# Altium project AMC_FMC_Carrier v4.PrjPcb (part 13 of 17)

## Sheet Clock_management.SchDoc: AMC FMC Carrier v4
size 420 x 297 mm; CompanyName: WUT; Organization: WUT ISE; Address1: Warsaw University of Technology; Address2: Nowowiejska 15/19 00-665 Warsaw; Address3: t.przywozki@gmail.com; Revision: 1; SheetNumber: 22; SheetTotal: 29; Project: AMC FMC Carrier v4.0.2; ModifiedBy: M. Biernat; CheckedDate: -; Title2: Clock Management; DivGrp: ISE; Designer: T. Przywozki; ModifiedDate: -; ProjectName: ADC/DAC MEZZANINE
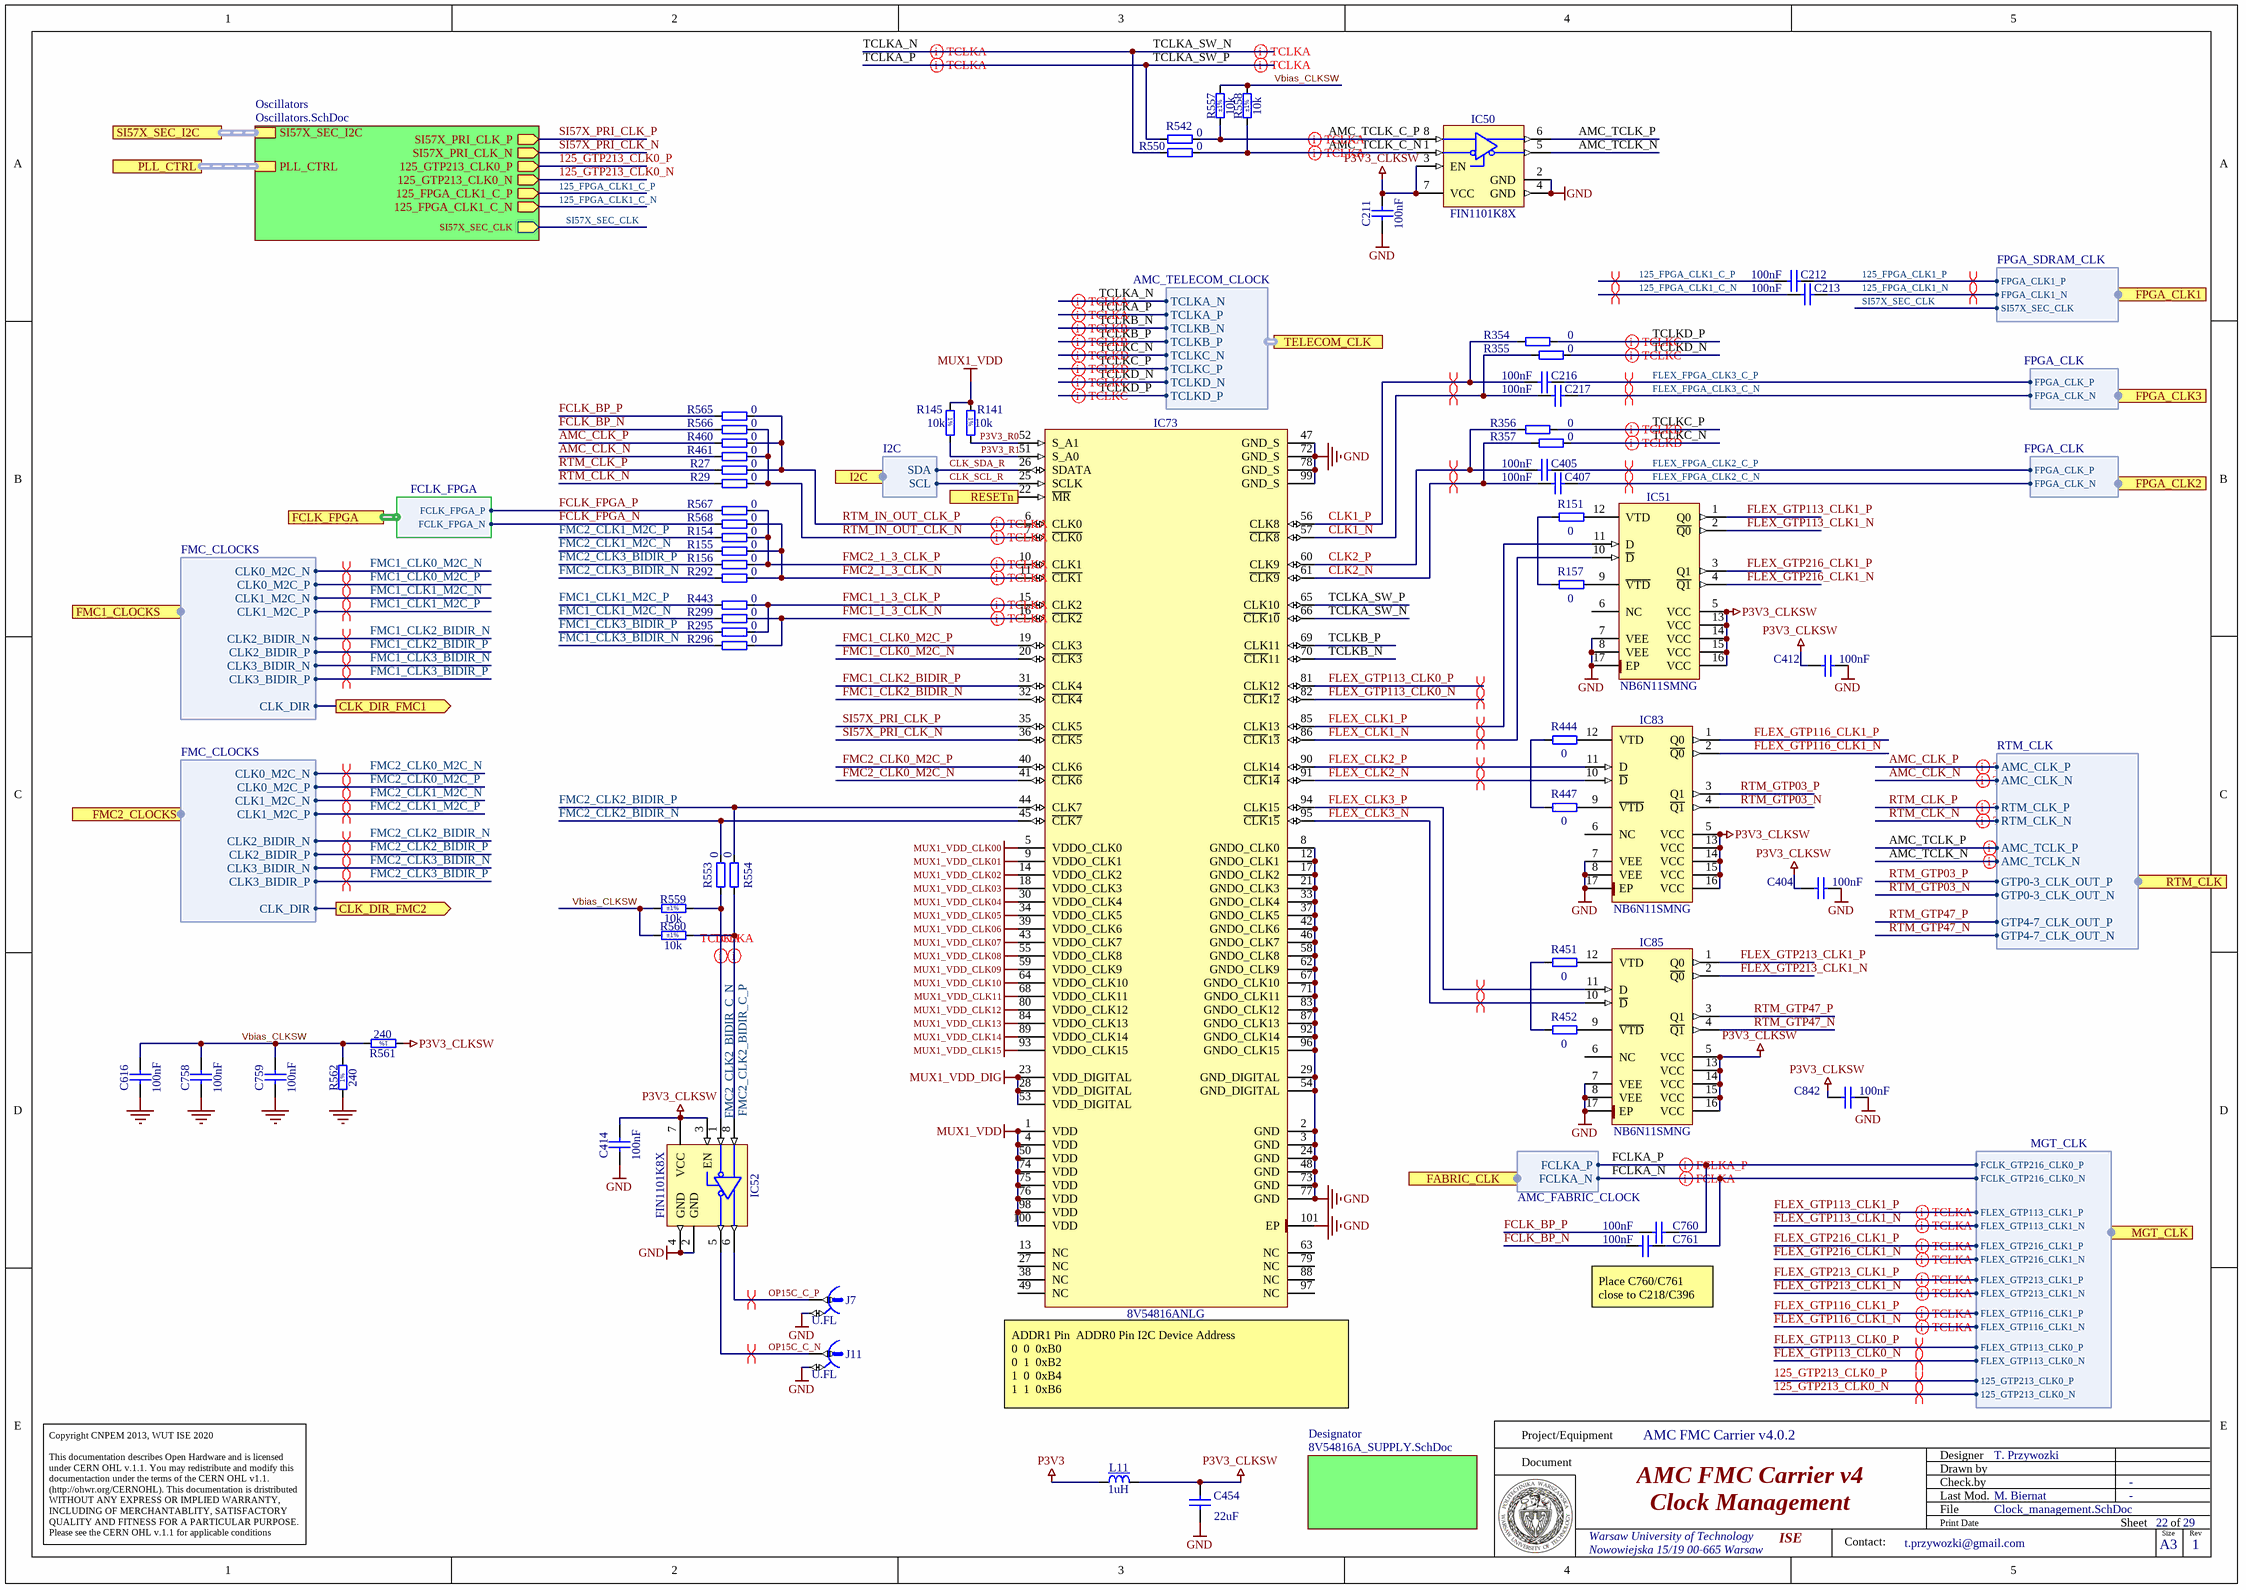
[diagram p23: Clock_management.SchDoc]

### Parts
C211  100nF  [CAPC1005X55N]
C212  100nF  [CAPC0603X33N]
C213  100nF  [CAPC0603X33N]
C216  100nF  [CAPC0603X33N]
C217  100nF  [CAPC0603X33N]
C404  100nF  [CAPC0603X33N]
C405  100nF  [CAPC0603X33N]
C407  100nF  [CAPC0603X33N]
C412  100nF  [CAPC0603X33N]
C414  100nF  [CAPC1005X55N]
C454  22uF  [CAPC3216X180N]
C616  100nF  [CAPC1005X55N]
C758  100nF  [CAPC1005X55N]
C759  100nF  [CAPC1005X55N]
C760  100nF  [CAPC0603X33N]
C761  100nF  [CAPC0603X33N]
C842  100nF  [CAPC0603X33N]
IC50  FIN1101K8X  [SOP50P310X90-8N]
IC51  NB6N11SMNG  [QFN50P300X300X100-17N-S185]
IC52  FIN1101K8X  [SOP50P310X90-8N]
IC73  8V54816ANLG  [QFN40P1200X1200X90-101N-S690]
IC83  NB6N11SMNG  [QFN50P300X300X100-17N-S185]
IC85  NB6N11SMNG  [QFN50P300X300X100-17N-S185]
J7  U.FL  [HIROSE_U.FL-R-SMT-1(10)]
J11  U.FL  [HIROSE_U.FL-R-SMT-1(10)]
L11  1uH  [IND_PANASONIC_ELLVGG]
R27  0  [RESC1005X40N]
R29  0  [RESC1005X40N]
R141  10k  [RESC1005X40N]
R145  10k  [RESC1005X40N]
R151  0  [RESC1005X40N]
R154  0  [RESC1005X40N]
R155  0  [RESC1005X40N]
R156  0  [RESC1005X40N]
R157  0  [RESC1005X40N]
R292  0  [RESC1005X40N]
R295  0  [RESC1005X40N]
R296  0  [RESC1005X40N]
R299  0  [RESC1005X40N]
R354  0  [RESC0603X28N]
R355  0  [RESC0603X28N]
R356  0  [RESC0603X28N]
R357  0  [RESC0603X28N]
R443  0  [RESC1005X40N]
R444  0  [RESC1005X40N]
R447  0  [RESC1005X40N]
R451  0  [RESC1005X40N]
R452  0  [RESC1005X40N]
R460  0  [RESC1005X40N]
R461  0  [RESC1005X40N]
R542  0  [RESC1005X40N]
R550  0  [RESC1005X40N]
R553  0  [RESC1005X40N]
R554  0  [RESC1005X40N]
R557  10k  Tolerance: ±1%  [RESC1005X40N]
R558  10k  Tolerance: ±1%  [RESC1005X40N]
R559  10k  Tolerance: ±1%  [RESC1005X40N]
R560  10k  Tolerance: ±1%  [RESC1005X40N]
R561  240  [RESC1005X40N]
R562  240  [RESC1005X40N]
R565  0  [RESC1005X40N]
R566  0  [RESC1005X40N]
R567  0  [RESC1005X40N]
R568  0  [RESC1005X40N]

### Sub-sheets
Designator = 8V54816A_SUPPLY.SchDoc: no entries
Oscillators = Oscillators.SchDoc: SI57X_PRI_CLK_P (out), SI57X_PRI_CLK_N (out), SI57X_SEC_CLK (out), 125_FPGA_CLK1_C_N (out), 125_FPGA_CLK1_C_P (out), 125_GTP213_CLK0_N (out), 125_GTP213_CLK0_P (out), SI57X_SEC_I2C (harness SI57X_SEC_I2C), PLL_CTRL (harness PLL_CTRL)

### Ports
CLK_DIR_FMC1 (out), CLK_DIR_FMC2 (out), FABRIC_CLK (harness AMC_FABRIC_CLOCK), FCLK_FPGA (harness FCLK_FPGA), FMC1_CLOCKS (harness FMC_CLOCKS), FMC2_CLOCKS (harness FMC_CLOCKS), FPGA_CLK1 (harness FPGA_SDRAM_CLK), FPGA_CLK2 (harness FPGA_CLK), FPGA_CLK3 (harness FPGA_CLK), I2C (harness I2C), MGT_CLK (harness MGT_CLK), PLL_CTRL (harness PLL_CTRL), RESETn (in), RTM_CLK (harness RTM_CLK), SI57X_SEC_I2C (harness SI57X_SEC_I2C), TELECOM_CLK (harness AMC_TELECOM_CLOCK)

### Harnesses
AMC_FABRIC_CLOCK: FCLKA_N, FCLKA_P
AMC_TELECOM_CLOCK: TCLKA_N, TCLKA_P, TCLKB_N, TCLKB_P, TCLKC_N, TCLKC_P, TCLKD_N, TCLKD_P
MGT_CLK: FCLK_GTP216_CLK0_P, FCLK_GTP216_CLK0_N, FLEX_GTP216_CLK1_P, FLEX_GTP216_CLK1_N, FLEX_GTP113_CLK1_P, FLEX_GTP113_CLK1_N, FLEX_GTP213_CLK1_P, FLEX_GTP213_CLK1_N, FLEX_GTP116_CLK1_P, FLEX_GTP116_CLK1_N, FLEX_GTP113_CLK0_P, FLEX_GTP113_CLK0_N, 125_GTP213_CLK0_P, 125_GTP213_CLK0_N
FPGA_SDRAM_CLK: FPGA_CLK1_N, FPGA_CLK1_P, SI57X_SEC_CLK
I2C: SCL, SDA
FMC_CLOCKS: CLK0_M2C_N, CLK0_M2C_P, CLK1_M2C_N, CLK1_M2C_P, CLK_DIR, CLK2_BIDIR_N, CLK2_BIDIR_P, CLK3_BIDIR_N, CLK3_BIDIR_P
FPGA_CLK: FPGA_CLK_N, FPGA_CLK_P
RTM_CLK: GTP0-3_CLK_OUT_P, GTP0-3_CLK_OUT_N, GTP4-7_CLK_OUT_P, GTP4-7_CLK_OUT_N, AMC_TCLK_P, AMC_TCLK_N, RTM_CLK_P, RTM_CLK_N, AMC_CLK_P, AMC_CLK_N
FCLK_FPGA: FCLK_FPGA_N, FCLK_FPGA_P

### Nets
GND: C211.1 C404.1 C412.1 C414.1 C454.1 C616.1 C758.1 C759.1 C842.1 IC50.2(GND) IC50.4(GND) IC51.7(VEE) IC51.8(VEE) IC51.17(EP) IC52.2(GND) IC52.4(GND) IC73.2(GND) IC73.3(GND) IC73.8(GNDO_CLK0) IC73.12(GNDO_CLK1) IC73.17(GNDO_CLK2) IC73.21(GNDO_CLK3) IC73.24(GND) IC73.29(GND_DIGITAL) IC73.33(GNDO_CLK4) IC73.37(GNDO_CLK5) IC73.42(GNDO_CLK6) IC73.46(GNDO_CLK7) IC73.47(GND_S) IC73.48(GND) IC73.54(GND_DIGITAL) IC73.58(GNDO_CLK8) IC73.62(GNDO_CLK9) IC73.67(GNDO_CLK10) IC73.71(GNDO_CLK11) IC73.72(GND_S) IC73.73(GND) IC73.77(GND) IC73.78(GND_S) IC73.83(GNDO_CLK12) IC73.87(GNDO_CLK13) IC73.92(GNDO_CLK14) IC73.96(GNDO_CLK15) IC73.99(GND_S) IC73.101(EP) IC83.7(VEE) IC83.8(VEE) IC83.17(EP) IC85.7(VEE) IC85.8(VEE) IC85.17(EP) J7.2 J11.2 R562.1
MUX1_VDD: IC73.1(VDD) IC73.4(VDD) IC73.50(VDD) IC73.74(VDD) IC73.75(VDD) IC73.76(VDD) IC73.98(VDD) IC73.100(VDD) R141.2 R145.2
MUX1_VDD_CLK00: IC73.5(VDDO_CLK0)
MUX1_VDD_CLK01: IC73.9(VDDO_CLK1)
MUX1_VDD_CLK02: IC73.14(VDDO_CLK2)
MUX1_VDD_CLK03: IC73.18(VDDO_CLK3)
MUX1_VDD_CLK04: IC73.30(VDDO_CLK4)
MUX1_VDD_CLK05: IC73.34(VDDO_CLK5)
MUX1_VDD_CLK06: IC73.39(VDDO_CLK6)
MUX1_VDD_CLK07: IC73.43(VDDO_CLK7)
MUX1_VDD_CLK08: IC73.55(VDDO_CLK8)
MUX1_VDD_CLK09: IC73.59(VDDO_CLK9)
MUX1_VDD_CLK10: IC73.64(VDDO_CLK10)
MUX1_VDD_CLK11: IC73.68(VDDO_CLK11)
MUX1_VDD_CLK12: IC73.80(VDDO_CLK12)
MUX1_VDD_CLK13: IC73.84(VDDO_CLK13)
MUX1_VDD_CLK14: IC73.89(VDDO_CLK14)
MUX1_VDD_CLK15: IC73.93(VDDO_CLK15)
MUX1_VDD_DIG: IC73.23(VDD_DIGITAL) IC73.28(VDD_DIGITAL) IC73.53(VDD_DIGITAL)
P3V3: L11.1
P3V3_CLKSW: C211.2 C404.2 C412.2 C414.2 C454.2 C842.2 IC50.3(EN) IC50.7(VCC) IC51.5(VCC) IC51.13(VCC) IC51.14(VCC) IC51.15(VCC) IC51.16(VCC) IC52.3(EN) IC52.7(VCC) IC83.5(VCC) IC83.13(VCC) IC83.14(VCC) IC83.15(VCC) IC83.16(VCC) IC85.5(VCC) IC85.13(VCC) IC85.14(VCC) IC85.15(VCC) IC85.16(VCC) L11.2 R561.1
125_FPGA_CLK1_C_N: C213.1 ; sheet Oscillators/125_FPGA_CLK1_C_N
125_FPGA_CLK1_C_P: C212.1 ; sheet Oscillators/125_FPGA_CLK1_C_P
125_FPGA_CLK1_N: C213.2 ; port FPGA_CLK1.FPGA_CLK1_N  [project net FPGA_CLK.FPGA_CLK1_N]
125_FPGA_CLK1_P: C212.2 ; port FPGA_CLK1.FPGA_CLK1_P  [project net FPGA_CLK.FPGA_CLK1_P]
125_GTP213_CLK0_N: sheet Oscillators/125_GTP213_CLK0_N, port MGT_CLK.125_GTP213_CLK0_N  [project net MGT.125_GTP213_CLK0_N]
125_GTP213_CLK0_P: sheet Oscillators/125_GTP213_CLK0_P, port MGT_CLK.125_GTP213_CLK0_P  [project net MGT.125_GTP213_CLK0_P]
AMC_CLK_N: R461.1 ; port RTM_CLK.AMC_CLK_N
AMC_CLK_P: R460.1 ; port RTM_CLK.AMC_CLK_P
AMC_TCLK_C_N: IC50.1(RIN-) R550.2 R558.1
AMC_TCLK_C_P: IC50.8(RIN+) R542.2 R557.1
AMC_TCLK_N: IC50.5(DOUT-) ; port RTM_CLK.AMC_TCLK_N
AMC_TCLK_P: IC50.6(DOUT+) ; port RTM_CLK.AMC_TCLK_P
CLK1_N: C217.1 IC73.57(~{CLK8}) R355.1
CLK1_P: C216.1 IC73.56(CLK8) R354.1
CLK2_N: C407.1 IC73.61(~{CLK9}) R357.1
CLK2_P: C405.1 IC73.60(CLK9) R356.1
CLK_DIR: port CLK_DIR_FMC2, port FMC2_CLOCKS.CLK_DIR
CLK_SCL_R: IC73.25(SCLK) ; port I2C.SCL  [project net CLK_I2C.SCL]
CLK_SDA_R: IC73.26(SDATA) ; port I2C.SDA  [project net CLK_I2C.SDA]
CLKS1.CLK_DIR: port CLK_DIR_FMC1, port FMC1_CLOCKS.CLK_DIR
FCLK_BP_N: C761.1 R566.1
FCLK_BP_P: C760.1 R565.1
FCLK_FPGA_N: R568.1 ; port FCLK_FPGA.FCLK_FPGA_N
FCLK_FPGA_P: R567.1 ; port FCLK_FPGA.FCLK_FPGA_P
FCLKA_N: C761.2 ; port FABRIC_CLK.FCLKA_N, port MGT_CLK.FCLK_GTP216_CLK0_N  [project net MGT.FCLK_GTP216_CLK0_N]
FCLKA_P: C760.2 ; port FABRIC_CLK.FCLKA_P, port MGT_CLK.FCLK_GTP216_CLK0_P  [project net MGT.FCLK_GTP216_CLK0_P]
FLEX_CLK1_N: IC51.10(~{D}) IC73.86(~{CLK}1~{3})
FLEX_CLK1_P: IC51.11(D) IC73.85(CLK13)
FLEX_CLK2_N: IC73.91(~{CLK}1~{4}) IC83.10(~{D})
FLEX_CLK2_P: IC73.90(CLK14) IC83.11(D)
FLEX_CLK3_N: IC73.95(~{CLK}1~{5}) IC85.10(~{D})
FLEX_CLK3_P: IC73.94(CLK15) IC85.11(D)
FLEX_FPGA_CLK2_C_N: C407.2 ; port FPGA_CLK2.FPGA_CLK_N
FLEX_FPGA_CLK2_C_P: C405.2 ; port FPGA_CLK2.FPGA_CLK_P
FLEX_FPGA_CLK3_C_N: C217.2 ; port FPGA_CLK3.FPGA_CLK_N
FLEX_FPGA_CLK3_C_P: C216.2 ; port FPGA_CLK3.FPGA_CLK_P
FLEX_GTP113_CLK0_N: IC73.82(~{CLK}1~{2}) ; port MGT_CLK.FLEX_GTP113_CLK0_N  [project net MGT.FLEX_GTP113_CLK0_N]
FLEX_GTP113_CLK0_P: IC73.81(CLK12) ; port MGT_CLK.FLEX_GTP113_CLK0_P  [project net MGT.FLEX_GTP113_CLK0_P]
FLEX_GTP113_CLK1_N: IC51.2(~{Q0}) ; port MGT_CLK.FLEX_GTP113_CLK1_N  [project net MGT.FLEX_GTP113_CLK1_N]
FLEX_GTP113_CLK1_P: IC51.1(Q0) ; port MGT_CLK.FLEX_GTP113_CLK1_P  [project net MGT.FLEX_GTP113_CLK1_P]
FLEX_GTP116_CLK1_N: IC83.2(~{Q0}) ; port MGT_CLK.FLEX_GTP116_CLK1_N  [project net MGT.FLEX_GTP116_CLK1_N]
FLEX_GTP116_CLK1_P: IC83.1(Q0) ; port MGT_CLK.FLEX_GTP116_CLK1_P  [project net MGT.FLEX_GTP116_CLK1_P]
FLEX_GTP213_CLK1_N: IC85.2(~{Q0}) ; port MGT_CLK.FLEX_GTP213_CLK1_N  [project net MGT.FLEX_GTP213_CLK1_N]
FLEX_GTP213_CLK1_P: IC85.1(Q0) ; port MGT_CLK.FLEX_GTP213_CLK1_P  [project net MGT.FLEX_GTP213_CLK1_P]
FLEX_GTP216_CLK1_N: IC51.4(~{Q1}) ; port MGT_CLK.FLEX_GTP216_CLK1_N  [project net MGT.FLEX_GTP216_CLK1_N]
FLEX_GTP216_CLK1_P: IC51.3(Q1) ; port MGT_CLK.FLEX_GTP216_CLK1_P  [project net MGT.FLEX_GTP216_CLK1_P]
FMC1_1_3_CLK_N: IC73.16(~{CLK2}) R296.2 R299.2
FMC1_1_3_CLK_P: IC73.15(CLK2) R295.2 R443.2
FMC1_CLK0_M2C_N: IC73.20(~{CLK3}) ; port FMC1_CLOCKS.CLK0_M2C_N  [project net CLKS1.CLK0_M2C_N]
FMC1_CLK0_M2C_P: IC73.19(CLK3) ; port FMC1_CLOCKS.CLK0_M2C_P  [project net CLKS1.CLK0_M2C_P]
FMC1_CLK1_M2C_N: R299.1 ; port FMC1_CLOCKS.CLK1_M2C_N  [project net CLKS1.CLK1_M2C_N]
FMC1_CLK1_M2C_P: R443.1 ; port FMC1_CLOCKS.CLK1_M2C_P  [project net CLKS1.CLK1_M2C_P]
FMC1_CLK2_BIDIR_N: IC73.32(~{CLK4}) ; port FMC1_CLOCKS.CLK2_BIDIR_N  [project net CLKS1.CLK2_BIDIR_N]
FMC1_CLK2_BIDIR_P: IC73.31(CLK4) ; port FMC1_CLOCKS.CLK2_BIDIR_P  [project net CLKS1.CLK2_BIDIR_P]
FMC1_CLK3_BIDIR_N: R296.1 ; port FMC1_CLOCKS.CLK3_BIDIR_N  [project net CLKS1.CLK3_BIDIR_N]
FMC1_CLK3_BIDIR_P: R295.1 ; port FMC1_CLOCKS.CLK3_BIDIR_P  [project net CLKS1.CLK3_BIDIR_P]
FMC2_1_3_CLK_N: IC73.11(~{CLK1}) R155.2 R292.2 R568.2
FMC2_1_3_CLK_P: IC73.10(CLK1) R154.2 R156.2 R567.2
FMC2_CLK0_M2C_N: IC73.41(~{CLK6}) ; port FMC2_CLOCKS.CLK0_M2C_N  [project net CLK0_M2C_N]
FMC2_CLK0_M2C_P: IC73.40(CLK6) ; port FMC2_CLOCKS.CLK0_M2C_P  [project net CLK0_M2C_P]
FMC2_CLK1_M2C_N: R155.1 ; port FMC2_CLOCKS.CLK1_M2C_N  [project net CLK1_M2C_N]
FMC2_CLK1_M2C_P: R154.1 ; port FMC2_CLOCKS.CLK1_M2C_P  [project net CLK1_M2C_P]
FMC2_CLK2_BIDIR_C_N: IC52.1(RIN-) R553.1 R559.2
FMC2_CLK2_BIDIR_C_P: IC52.8(RIN+) R554.1 R560.2
FMC2_CLK2_BIDIR_N: IC73.45(~{CLK7}) R553.2 ; port FMC2_CLOCKS.CLK2_BIDIR_N  [project net CLK2_BIDIR_N]
FMC2_CLK2_BIDIR_P: IC73.44(CLK7) R554.2 ; port FMC2_CLOCKS.CLK2_BIDIR_P  [project net CLK2_BIDIR_P]
FMC2_CLK3_BIDIR_N: R292.1 ; port FMC2_CLOCKS.CLK3_BIDIR_N  [project net CLK3_BIDIR_N]
FMC2_CLK3_BIDIR_P: R156.1 ; port FMC2_CLOCKS.CLK3_BIDIR_P  [project net CLK3_BIDIR_P]
OP15C_C_N: IC52.5(DOUT-) J11.1
OP15C_C_P: IC52.6(DOUT+) J7.1
P3V3_R0: IC73.52(S_A1) R141.1
P3V3_R1: IC73.51(S_A0) R145.1
RESETn: IC73.22(~{MR}) ; port RESETn
RTM_CLK_N: R29.1 ; port RTM_CLK.RTM_CLK_N
RTM_CLK_P: R27.1 ; port RTM_CLK.RTM_CLK_P
RTM_GTP03_N: IC83.4(~{Q1}) ; port RTM_CLK.GTP0-3_CLK_OUT_N  [project net GTP0-3_CLK_OUT_N]
RTM_GTP03_P: IC83.3(Q1) ; port RTM_CLK.GTP0-3_CLK_OUT_P  [project net GTP0-3_CLK_OUT_P]
RTM_GTP47_N: IC85.4(~{Q1}) ; port RTM_CLK.GTP4-7_CLK_OUT_N  [project net GTP4-7_CLK_OUT_N]
RTM_GTP47_P: IC85.3(Q1) ; port RTM_CLK.GTP4-7_CLK_OUT_P  [project net GTP4-7_CLK_OUT_P]
RTM_IN_OUT_CLK_N: IC73.7(~{CLK0}) R29.2 R461.2 R566.2
RTM_IN_OUT_CLK_P: IC73.6(CLK0) R27.2 R460.2 R565.2
SI57X_PRI_CLK_N: IC73.36(~{CLK5}) ; sheet Oscillators/SI57X_PRI_CLK_N
SI57X_PRI_CLK_P: IC73.35(CLK5) ; sheet Oscillators/SI57X_PRI_CLK_P
SI57X_SEC_CLK: sheet Oscillators/SI57X_SEC_CLK, port FPGA_CLK1.SI57X_SEC_CLK  [project net FPGA_CLK.SI57X_SEC_CLK]
TCLKA_N: IC73.66(~{CLK}1~{0}) R550.1 ; port TELECOM_CLK.TCLKA_N  [also labelled TCLKA_SW_N]
TCLKA_P: IC73.65(CLK10) R542.1 ; port TELECOM_CLK.TCLKA_P  [also labelled TCLKA_SW_P]
TCLKB_N: IC73.70(~{CLK}11) ; port TELECOM_CLK.TCLKB_N
TCLKB_P: IC73.69(CLK11) ; port TELECOM_CLK.TCLKB_P
TCLKC_N: R357.2 ; port TELECOM_CLK.TCLKC_N
TCLKC_P: R356.2 ; port TELECOM_CLK.TCLKC_P
TCLKD_N: R355.2 ; port TELECOM_CLK.TCLKD_N
TCLKD_P: R354.2 ; port TELECOM_CLK.TCLKD_P
Vbias_CLKSW: C616.2 C758.2 C759.2 R557.2 R558.2 R559.1 R560.1 R561.2 R562.2
NetIC51_9: IC51.9(~{VTD}) R157.2
NetIC51_12: IC51.12(VTD) R151.2
NetIC83_9: IC83.9(~{VTD}) R447.2
NetIC83_12: IC83.12(VTD) R444.2
NetIC85_9: IC85.9(~{VTD}) R452.2
NetIC85_12: IC85.12(VTD) R451.2
NetR151_1: R151.1 R157.1
NetR444_1: R444.1 R447.1
NetR451_1: R451.1 R452.1

Not connected (* = marked no-connect by the designer): IC51 6(NC); IC73 13(NC) 27(NC) 38(NC) 49(NC) 63(NC) 79(NC) 88(NC) 97(NC); IC83 6(NC); IC85 6(NC)

### Buses and harness runs
harness port PLL_CTRL = sheet Oscillators/PLL_CTRL
harness port SI57X_SEC_I2C = sheet Oscillators/SI57X_SEC_I2C

### Layout directives
differential pair: 125_FPGA_CLK1_C_N, 125_FPGA_CLK1_C_P, AMC_CLK_N, AMC_CLK_P, AMC_TCLK_C_N, AMC_TCLK_C_P, AMC_TCLK_N, AMC_TCLK_P, CLK0_M2C_N, CLK0_M2C_P, CLK1_M2C_N, CLK1_M2C_P, CLK1_N, CLK1_P, CLK2_BIDIR_N, CLK2_BIDIR_P, CLK2_N, CLK2_P, CLK3_BIDIR_N, CLK3_BIDIR_P, CLKS1.CLK0_M2C_N, CLKS1.CLK0_M2C_P, CLKS1.CLK1_M2C_N, CLKS1.CLK1_M2C_P, CLKS1.CLK2_BIDIR_N, CLKS1.CLK2_BIDIR_P, CLKS1.CLK3_BIDIR_N, CLKS1.CLK3_BIDIR_P, FLEX_CLK1_N, FLEX_CLK1_P, FLEX_CLK2_N, FLEX_CLK2_P, FLEX_CLK3_N, FLEX_CLK3_P, FLEX_FPGA_CLK2_C_N, FLEX_FPGA_CLK2_C_P, FLEX_FPGA_CLK3_C_N, FLEX_FPGA_CLK3_C_P, FMC1_1_3_CLK_N, FMC1_1_3_CLK_P, FMC2_1_3_CLK_N, FMC2_1_3_CLK_P, FMC2_CLK2_BIDIR_C_N, FMC2_CLK2_BIDIR_C_P, FPGA_CLK.FPGA_CLK1_N, FPGA_CLK.FPGA_CLK1_P, MGT.125_GTP213_CLK0_N, MGT.125_GTP213_CLK0_P, MGT.FCLK_GTP216_CLK0_N, MGT.FCLK_GTP216_CLK0_P, MGT.FLEX_GTP113_CLK0_N, MGT.FLEX_GTP113_CLK0_P, MGT.FLEX_GTP113_CLK1_N, MGT.FLEX_GTP113_CLK1_P, MGT.FLEX_GTP116_CLK1_N, MGT.FLEX_GTP116_CLK1_P, MGT.FLEX_GTP213_CLK1_N, MGT.FLEX_GTP213_CLK1_P, MGT.FLEX_GTP216_CLK1_N, MGT.FLEX_GTP216_CLK1_P, OP15C_C_N, OP15C_C_P, RTM_CLK_N, RTM_CLK_P, RTM_IN_OUT_CLK_N, RTM_IN_OUT_CLK_P, TCLKA_N, TCLKA_P, TCLKB_N, TCLKB_P, TCLKC_N, TCLKC_P, TCLKD_N, TCLKD_P

### Notes on the sheet
- Place C760/C761 close to C218/C396
- (near IC73) ADDR1 Pin 	ADDR0 Pin	I2C Device Address
  0		0		0xB0
  0		1		0xB2
  1		0		0xB4
  1		1		0xB6
- Project/Equipment
- Document
- Designer
- Drawn by
- Check.by
- Copyright CNPEM 2013, WUT ISE 2020
  This documentation describes Open Hardware and is licensed under CERN OHL v.1.1. You may redistribute and modify this documentaction under the terms of the CERN OHL v1.1.
  (http://ohwr.org/CERNOHL). This documentation is dristributed WITHOUT ANY EXPRESS OR IMPLIED WARRANTY, INCLUDING OF MERCHANTABLITY, SATISFACTORY QUALITY AND FITNESS FOR A PARTICULAR PURPOSE. Please see the CERN OHL v.1.1 for applicable conditions
- File
- Last Mod.
- Print Date
- Sheet
- Size
- A3
- of
- Rev
- Contact:
- (in symbol R0402_10K_1%_0.0625W_100PPM) 1%
- (in symbol R0402_240R_1%_0.0625W_100PPM) 1%

### Library data of the parts
C211 C414 C616 C758 C759 = CC0402_100NF_16V_10%_X5R: Non-polarised capacitor; Manufacturer: GENERIC; Part Description: SMD Multilayer Chip Ceramic Capacitor; Manufacturer1 Part Number: GRM155R61C104KA88D; Tolerance: ±10%; Voltage: 16V; TC: X5R; Manufacturer Part Number: CC0402_100NF_16V_10%_X5R; Part Number: CC0402_100NF_16V_10%_X5R; Value: 100nF; Component Kind: Standard; Component Type: Standard; Pin Count: 2; Status: None; Case: 0402; Mounted: Yes; Socket: No; SMD: Yes; Sense: No; Manufacturer1 Example: MURATA; Manufacturer1 ComponentHeight: 0.55mm; HelpURL: \\cern.ch\dfs\Applications\Altium\Datasheets\CC0402_X5R_MURATA_GRM.pdf; Author: CERN DEM JLC; CreateDate: 10.12.2013; LatestRevisionDate: 10.12.2013
C212 C213 C216 C217 C404 C405 C407 C412 C760 C761 C842 = CC0201_100NF_6.3V_10%_X5R: Non-polarised capacitor; Part Description: SMD Multilayer Chip Ceramic Capacitor; Manufacturer: GENERIC; Manufacturer1 Part Number: 02016D104KAT2A; Voltage: 6.3V; TC: X5R; Tolerance: ±10%; Table: Capacitors SMD; Part Number: CC0201_100NF_6.3V_10%_X5R; Component Kind: Standard; Component Type: Standard; Pin Count: 2; Value: 100nF; Status: Not Recommended; Manufacturer Part Number: CC0201_100NF_6.3V_10%_X5R; Case: 0201; Mounted: Yes; Socket: No; SMD: Yes; Manufacturer1 Example: AVX; Manufacturer1 ComponentHeight: 0.33mm; HelpURL: \\cern.ch\dfs\Applications\Altium\Datasheets\CC0201_X5R_AVX.pdf; Author: CERN DEM JLC; CreateDate: 2007-12-03; LatestRevisionDate: 2007-12-03
C454 = CC1206_22UF_10V_10%_X7R: Non-polarised capacitor; Part Description: SMD Multilayer Chip Ceramic Capacitor; Manufacturer: GENERIC; Manufacturer1 Part Number: GRM31CR71A226KE15L; Voltage: 10V; TC: X7R; Tolerance: ±10%; Table: Capacitors SMD; Part Number: CC1206_22UF_10V_10%_X7R; Component Kind: Standard; Component Type: Standard; Pin Count: 2; Value: 22uF; Status: Preferred; Manufacturer Part Number: CC1206_22UF_10V_10%_X7R; Case: 1206; Mounted: Yes; Socket: No; SMD: Yes; Manufacturer1 Example: MURATA; Manufacturer1 ComponentHeight: 1.8mm; HelpURL: \\cern.ch\dfs\Applications\Altium\Datasheets\CC1206_X7R_MURATA_GRM-HI-CAP.pdf; Author: CERN DEM JLC; CreateDate: 2010-06-08; LatestRevisionDate: 2010-06-08
IC50 IC52 = FIN1101K8X: LVDS Single Port High Speed Repeater; Manufacturer: FAIRCHILD SEMICONDUCTOR; PressFit: No; Bonding: No; Part Number: FIN1101K8X; Component Kind: Standard; Component Type: Standard; Device: FIN1101K8X; PackageDescription: SOP, 0.50mm Pitch; 8 pin, 2.30mm W X 2.00mm L X 0.90mm H body, PC Medium Density; Part Description: LVDS Single Port High Speed Repeater; Manufacturer Part Number: FIN1101K8X; Pin Count: 8; Case: TSSOP8; Mounted: Yes; Socket: No; SMD: Yes; Sense: No; ComponentHeight: 0.8mm; Author: CERN DEM JLC; HelpURL: \\cern.ch\dfs\Applications\Altium\Datasheets\FIN1101K8X.pdf; CreateDate: 08.11.2016; LatestRevisionDate: 08.11.2016
IC51 IC83 IC85 = NB6N11SMNG: 3.3V 1:2 AnyLevel Input to LVDS Fanout Buffer / Translator; Manufacturer: ON SEMICONDUCTOR; PressFit: No; Bonding: No; Part Number: NB6N11SMNG; Component Kind: Standard; Component Type: Standard; Device: NB6N11SMNG; PackageDescription: QFN, 0.50mm Pitch, Square; 16 Pin, 3.00mm L X 3.00mm W X 1.00mm H body (w/Thermal Tab 1.85 X 1.85mm), IPC Medium Density; Part Description: 3.3V 1:2 AnyLevel Input to LVDS Fanout Buffer / Translator; Manufacturer Part Number: NB6N11SMNG; Pin Count: 17; Case: QFN16; Mounted: Yes; Socket: No; SMD: Yes; Sense: No; ComponentHeight: 1mm; Author: CERN DEM JLC; HelpURL: \\cern.ch\dfs\Applications\Altium\Datasheets\NB6N11SMNG.pdf; CreateDate: 14.05.2013; LatestRevisionDate: 14.05.2013
IC73 = 8V54816ANLG: 16-Port, Bi-directional M-LVDS Clock Cross-Point Switch; Manufacturer: INTEGRATED DEVICE TECHNOLOGY (IDT); PressFit: No; Bonding: No; Part Number: 8V54816ANLG; Component Kind: Standard; Component Type: Standard; Device: 8V54816ANLG; PackageDescription: QFN, 0.40mm Pitch, Square; 100 Pin, 12.0mm L X 12.0mm W X 0.90mm H body (w/Thermal Tab 6.90 X 6.90mm), IPC Medium Density; Status: Not Recommended; Part Description: 16-Port, Bi-directional M-LVDS Clock Cross-Point Switch; Manufacturer Part Number: 8V54816ANLG; Pin Count: 101; Case: QFN100; Mounted: Yes; Socket: No; SMD: Yes; Sense: No; ComponentHeight: 0.9mm; Author: CERN DEM MR; HelpURL: \\cern.ch\dfs\Applications\Altium\Datasheets\8V54816ANLG.pdf; CreateDate: 02.06.2016; LatestRevisionDate: 30.03.2017
J7 J11 = HIROSE_U.FL-R-SMT-1(10): Part Description: Up to 6GHz Ultra Small Surface Mount Male Coaxial Connectors U.FL Series; Manufacturer: HIROSE (HRS); PressFit: No; Part Number: HIROSE_U.FL-R-SMT-1(10); Component Kind: Standard; Component Type: Standard; Pin Count: 2; Family: U.FL; Mounted: Yes; Socket: No; SMD: Yes; Sense: No; Status: None; Manufacturer Part Number: U.FL-R-SMT-1(10); ComponentHeight: 1.25mm; HelpURL: \\cern.ch\dfs\Applications\Altium\Datasheets\HIROSE_U.FL-R-SMT-1(10).pdf; Author: CERN DEM JLC; CreateDate: 24.03.2010; LatestRevisionDate: 24.03.2010
L11 = IND_1UH_30%_PANASONIC_ELLVGG1R0N: Inductor With Core; Part Description: Wire Wound SMD Power Inductor, G Series, Type ELLVGG; Power: 1.8A; Resistance: 0.052R; Tolerance: ±30%; Part Number: IND_1UH_30%_PANASONIC_ELLVGG1R0N; Component Kind: Standard; Component Type: Standard; Pin Count: 2; Value: 1uH; Status: None; Manufacturer: PANASONIC; Manufacturer Part Number: ELLVGG1R0N; Mounted: Yes; Socket: No; SMD: Yes; Sense: No; ComponentHeight: 1.5mm; HelpURL: \\cern.ch\dfs\Applications\Altium\Datasheets\IND_PANASONIC_ELLVGG.pdf; Author: CERN DEM JLC; CreateDate: 09.11.2016; LatestRevisionDate: 09.11.2016
R27 R29 R151 R154-R157 R292 R295 R296 R299 R443 R444 R447 R451 R452 R460 R461 R542 R550 R553 R554 R565-R568 = R0402_0R_JUMPER: Resistor; Part Description: 1A (0.05R Max DC Resistance) Zero Ohm Jumper; Manufacturer: GENERIC; Manufacturer1 Part Number: 232270591001L; PressFit: No; Part Number: R0402_0R_JUMPER; Component Kind: Standard; Component Type: Standard; Pin Count: 2; Value: 0; Status: Not Recommended; Manufacturer Part Number: R0402_0R_JUMPER; Case: 0402; Mounted: Yes; Sense: No; Socket: No; SMD: Yes; Manufacturer1 Example: YAGEO PHYCOMP; Manufacturer1 ComponentHeight: 0.4mm; HelpURL: \\cern.ch\dfs\Applications\Altium\Datasheets\R0402_Phycomp_RC0402.pdf; Author: CERN DEM JLC; CreateDate: 03.12.2007; LatestRevisionDate: 17.10.2012
R141 R145 = R0402_10K_1%_0.0625W_100PPM: Resistor - 1%; Part Description: General Purpose Thick Film Chip Resistor; Manufacturer: GENERIC; Manufacturer1 Part Number: 232270671003L; TC: ±100ppm/°C; Table: Resistors SMD; Part Number: R0402_10K_1%_0.0625W_100PPM; Component Kind: Standard; Component Type: Standard; Pin Count: 2; Value: 10k; Status: Not recommended; Power: 0.0625W; Tolerance: ±1%; Manufacturer Part Number: R0402_10K_1%_0.0625W_100PPM; Case: 0402; Mounted: Yes; Socket: No; SMD: Yes; Manufacturer1 Example: YAGEO PHYCOMP; Manufacturer1 ComponentHeight: 0.4mm; HelpURL: \\cern.ch\dfs\Applications\Altium\Datasheets\R0402_Phycomp_RC0402.pdf; Author: CERN DEM JLC; CreateDate: 2007-12-03; LatestRevisionDate: 2012-10-17
R354-R357 = R0201_0R_JUMPER: Resistor; Part Description: 1A (0.05R Max DC Resistance) Zero Ohm Jumper; Manufacturer: GENERIC; Manufacturer1 Part Number: CRCW02010000Z0ED; PressFit: No; Part Number: R0201_0R_JUMPER; Component Kind: Standard; Component Type: Standard; Pin Count: 2; Value: 0; Status: Not Recommended; Manufacturer Part Number: R0201_0R_JUMPER; Case: 0201; Mounted: Yes; Sense: No; Socket: No; SMD: Yes; Manufacturer1 Example: VISHAY; Manufacturer1 ComponentHeight: 0.27mm; HelpURL: \\cern.ch\dfs\Applications\Altium\Datasheets\R0201_VISHAY_CRCW e3.pdf; Author: CERN DEM JLC; CreateDate: 19.11.2014; LatestRevisionDate: 08.01.2015
R557-R560 = R0402_10K_1%_0.0625W_100PPM: Resistor - 1%; Part Description: General Purpose Thick Film Chip Resistor; Manufacturer: GENERIC; Manufacturer1 Part Number: 232270671003L; TC: ±100ppm/°C; PressFit: No; Part Number: R0402_10K_1%_0.0625W_100PPM; Component Kind: Standard; Component Type: Standard; Pin Count: 2; Value: 10k; Status: Not Recommended; Power: 0.0625W; Manufacturer Part Number: R0402_10K_1%_0.0625W_100PPM; Case: 0402; Mounted: Yes; Sense: No; Socket: No; SMD: Yes; Manufacturer1 Example: YAGEO PHYCOMP; Manufacturer1 ComponentHeight: 0.4mm; HelpURL: \\cern.ch\dfs\Applications\Altium\Datasheets\R0402_Phycomp_RC0402.pdf; Author: CERN DEM JLC; CreateDate: 03.12.2007; LatestRevisionDate: 17.10.2012
R561 R562 = R0402_240R_1%_0.0625W_100PPM: Resistor - 1%; Manufacturer: GENERIC; Part Description: General Purpose Thick Film Chip Resistor; Manufacturer1 Part Number: 232270672401L; TC: ±100ppm/°C; PressFit: No; Manufacturer Part Number: R0402_240R_1%_0.0625W_100PPM; Part Number: R0402_240R_1%_0.0625W_100PPM; Tolerance: ±1%; Value: 240; Component Kind: Standard; Component Type: Standard; Pin Count: 2; Status: Not Recommended; Power: 0.0625W; Case: 0402; Mounted: Yes; Sense: No; Socket: No; SMD: Yes; Manufacturer1 Example: YAGEO PHYCOMP; Manufacturer1 ComponentHeight: 0.4mm; HelpURL: \\cern.ch\dfs\Applications\Altium\Datasheets\R0402_Phycomp_RC0402.pdf; Author: CERN DEM JLC; CreateDate: 03.12.2007; LatestRevisionDate: 17.10.2012

## Sheet Oscillators.SchDoc: AMC FMC Carrier v4
size 420 x 297 mm; CompanyName: WUT; Organization: WUT ISE; Address1: Warsaw University of Technology; Address2: Nowowiejska 15/19 00-665 Warsaw; Address3: t.przywozki@gmail.com; Revision: 1; SheetNumber: 23; SheetTotal: 29; Project: AMC FMC Carrier v4.0.2; ModifiedBy: F. Świtakowski; CheckedDate: -; Title2: Oscillators; DivGrp: ISE; Designer: T. Przywozki; ModifiedDate: -; ProjectName: ADC/DAC MEZZANINE
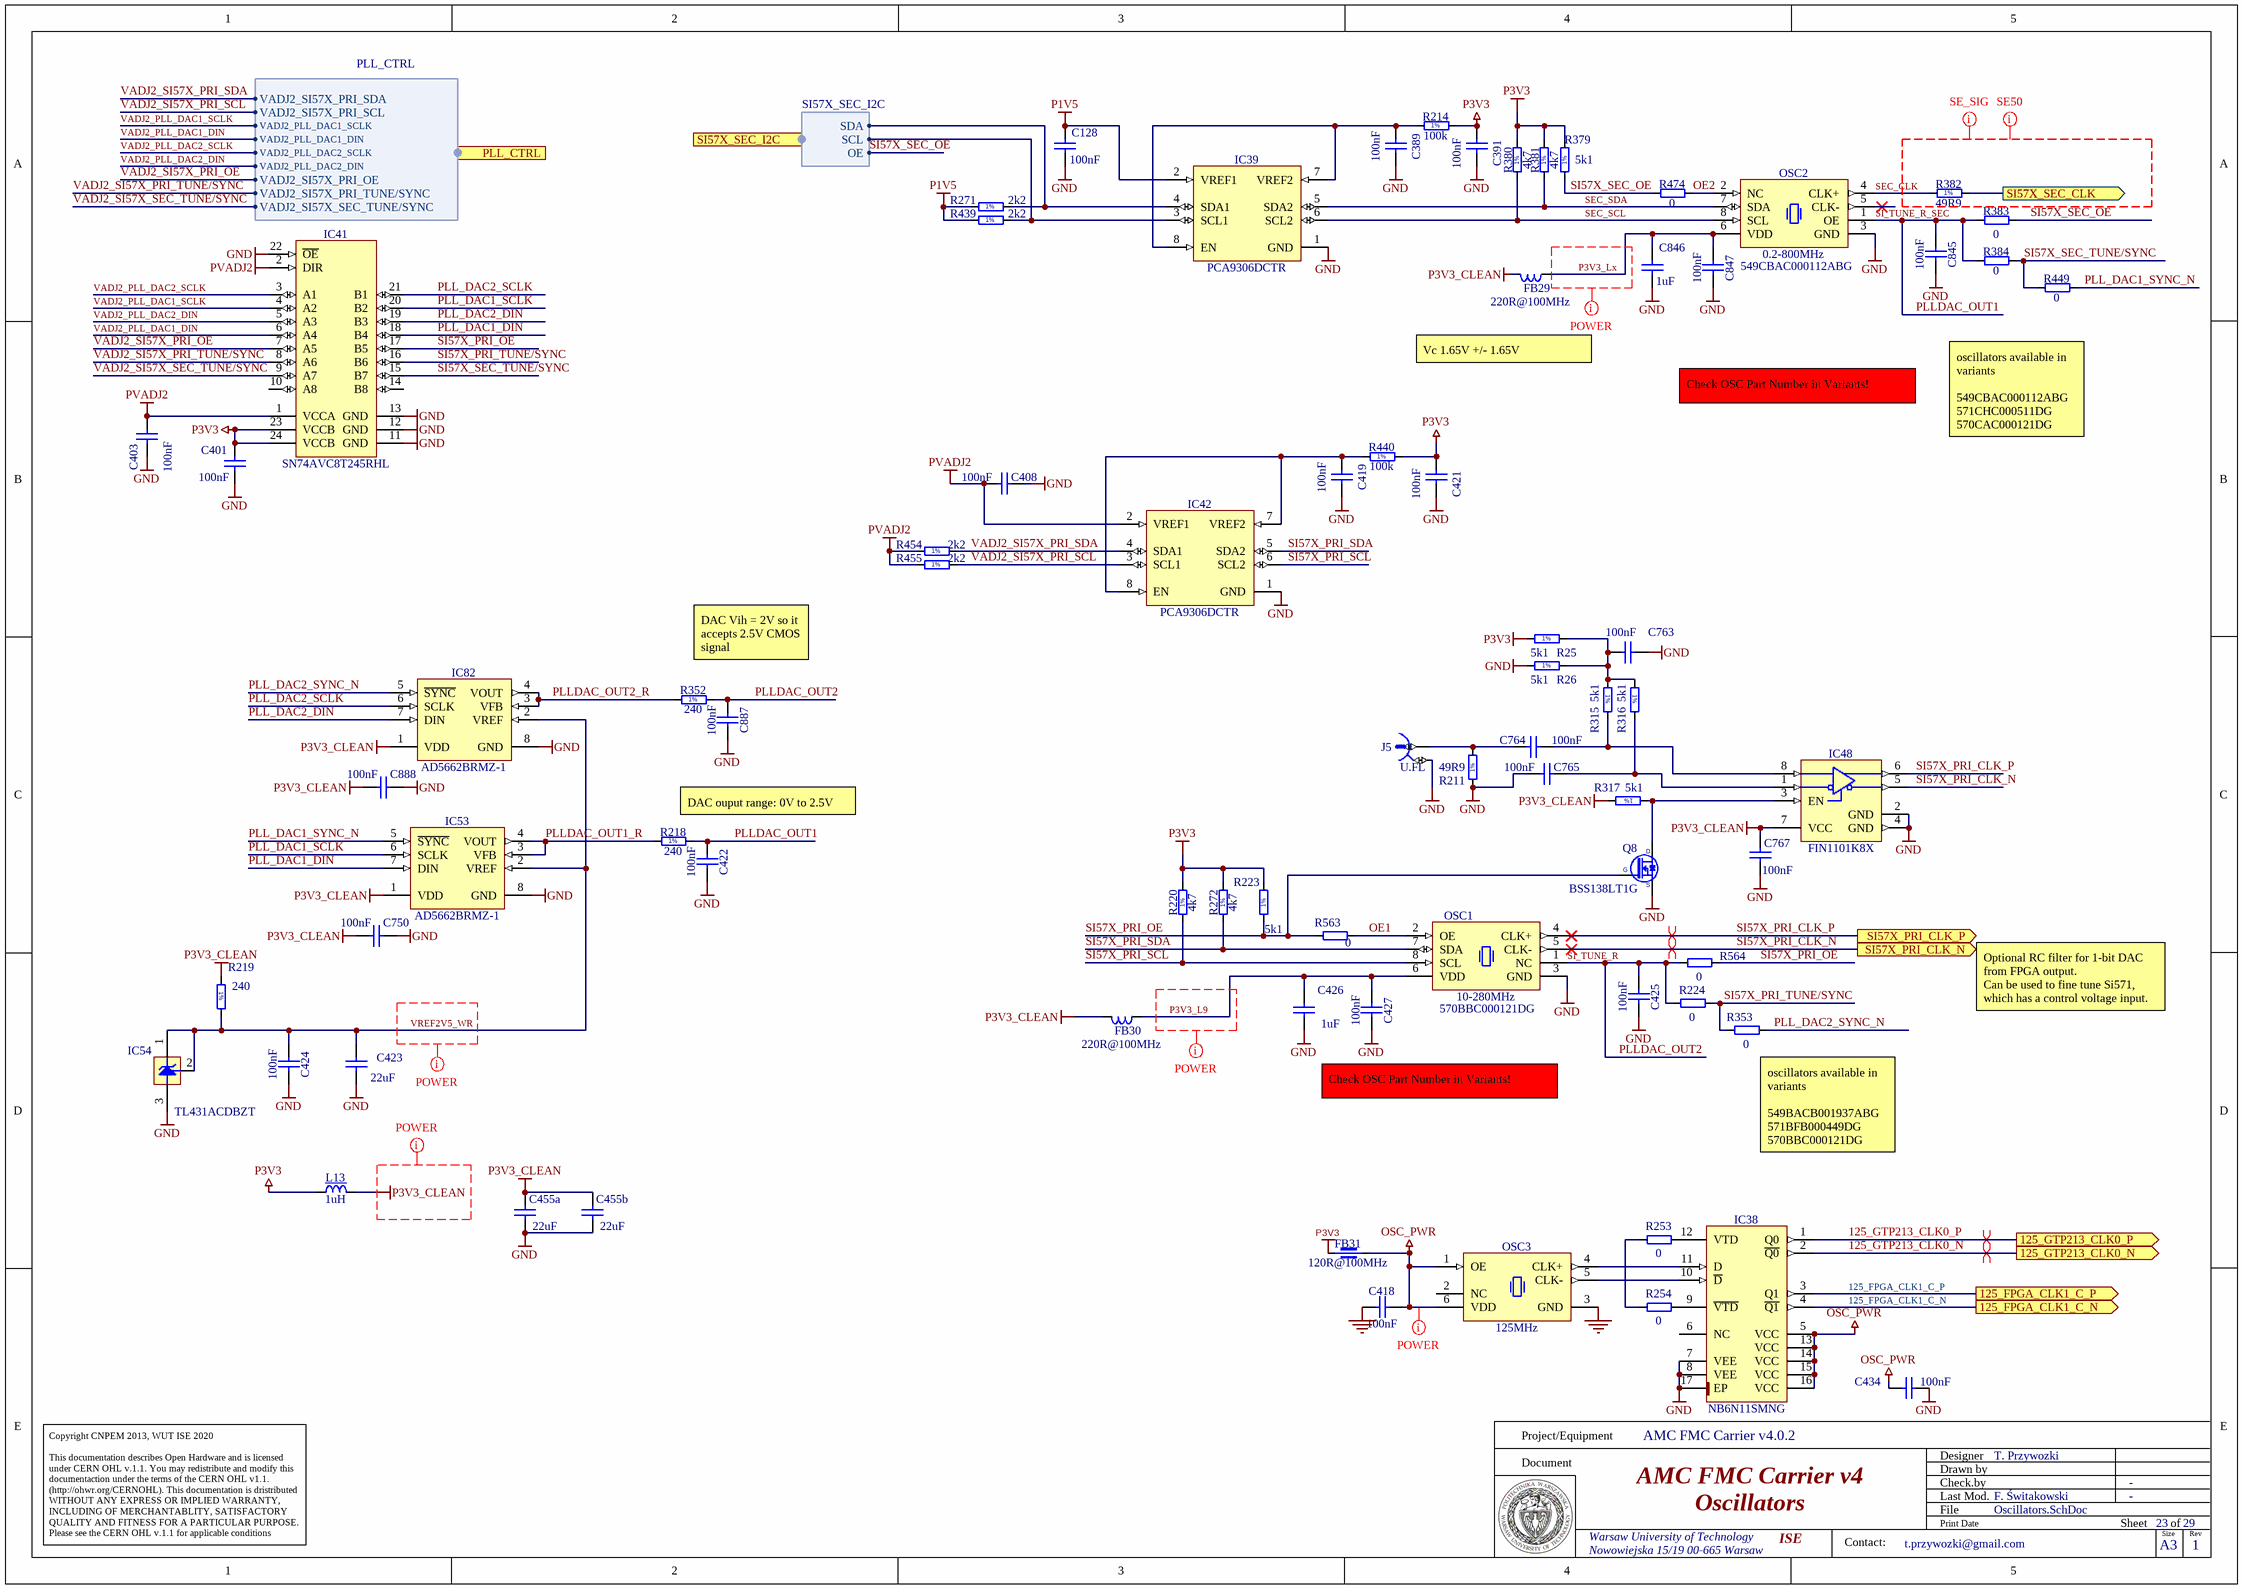
[diagram p24: Oscillators.SchDoc]

### Parts
C128  100nF  [CAPC0603X33N]
C389  100nF  [CAPC0603X33N]
C391  100nF  [CAPC0603X33N]
C401  100nF  [CAPC0603X33N]
C403  100nF  [CAPC0603X33N]
C408  100nF  [CAPC0603X33N]
C418  100nF  [CAPC0603X33N]
C419  100nF  [CAPC0603X33N]
C421  100nF  [CAPC0603X33N]
C422  100nF  [CAPC0603X33N]
C423  22uF  [CAPC3216X180N]
C424  100nF  [CAPC0603X33N]
C425  100nF  [CAPC0603X33N]
C426  1uF  [CAPC1608X87N]
C427  100nF  [CAPC0603X33N]
C434  100nF  [CAPC0603X33N]
C455a  22uF  [CAPC3216X180N]
C455b  22uF  [CAPC3216X180N]
C750  100nF  [CAPC0603X33N]
C763  100nF  [CAPC0603X33N]
C764  100nF  [CAPC0603X33N]
C765  100nF  [CAPC0603X33N]
C767  100nF  [CAPC0603X33N]
C845  100nF  [CAPC0603X33N]
C846  1uF  [CAPC1608X87N]
C847  100nF  [CAPC0603X33N]
C887  100nF  [CAPC0603X33N]
C888  100nF  [CAPC0603X33N]
FB29  220R@100MHz  [INDC2012X105N]
FB30  220R@100MHz  [INDC2012X105N]
FB31  120R@100MHz  [INDC1005X55N]
IC38  NB6N11SMNG  [QFN50P300X300X100-17N-S185]
IC39  PCA9306DCTR  [SOP65P400X130-8N]
IC41  SN74AVC8T245RHL  [TEXAS_RHL (S-PVQFN-N24)]
IC42  PCA9306DCTR  [SOP65P400X130-8N]
IC48  FIN1101K8X  [SOP50P310X90-8N]
IC53  AD5662BRMZ-1  [SOP65P490X110-8N]
IC54  TL431ACDBZT  [SOT95P237X112-3N]
IC82  AD5662BRMZ-1  [SOP65P490X110-8N]
J5  U.FL  [HIROSE_U.FL-R-SMT-1(10)]
L13  1uH  [IND_PANASONIC_ELLVGG]
OSC1  10-280MHz  Manufacturer Part Number: 570BBC000121DG  [OSC_SILICON-LAB_SI570]
OSC2  0.2-800MHz  Manufacturer Part Number: 549CBAC000112ABG  [OSC_SILICON-LAB_SI549-A]
OSC3  125MHz  [OSC_SILICON-LAB_SI511-6N(3.2X5)]
Q8  BSS138LT1G  [SOT95P240X110-3N]
R25  5k1  [RESC1608X55N]
R26  5k1  [RESC1608X55N]
R211  49R9  [RESC1005X40N]
R214  100k  [RESC1005X40N]
R218  240  [RESC1005X40N]
R219  240  [RESC1005X40N]
R220  4k7  [RESC1005X40N]
R223  5k1  [RESC1608X55N]
R224  0  [RESC1005X40N]
R253  0  [RESC1005X40N]
R254  0  [RESC1005X40N]
R271  2k2  [RESC1005X40N]
R272  4k7  [RESC1005X40N]
R315  5k1  [RESC1608X55N]
R316  5k1  [RESC1608X55N]
R317  5k1  [RESC1608X55N]
R352  240  [RESC1005X40N]
R353  0  [RESC1005X40N]
R379  5k1  [RESC1608X55N]
R380  4k7  [RESC1005X40N]
R381  4k7  [RESC1005X40N]
R382  49R9  [RESC1005X40N]
R383  0  [RESC1005X40N]
R384  0  [RESC1005X40N]
R439  2k2  [RESC1005X40N]
R440  100k  [RESC1005X40N]
R449  0  [RESC1005X40N]
R454  2k2  [RESC1005X40N]
R455  2k2  [RESC1005X40N]
R474  0  [RESC1005X40N]
R563  0  [RESC1005X40N]
R564  0  [RESC1005X40N]

### Ports
125_FPGA_CLK1_C_N (out), 125_FPGA_CLK1_C_P (out), 125_GTP213_CLK0_N (out), 125_GTP213_CLK0_P (out), PLL_CTRL (harness PLL_CTRL), SI57X_PRI_CLK_N (out), SI57X_PRI_CLK_P (out), SI57X_SEC_CLK (out), SI57X_SEC_I2C (harness SI57X_SEC_I2C)

### Harnesses
SI57X_SEC_I2C: SDA, SCL, OE
PLL_CTRL: VADJ2_PLL_DAC1_SCLK, VADJ2_PLL_DAC1_DIN, VADJ2_SI57X_PRI_OE, VADJ2_SI57X_PRI_TUNE/SYNC, VADJ2_SI57X_PRI_SDA, VADJ2_SI57X_PRI_SCL, VADJ2_SI57X_SEC_TUNE/SYNC, VADJ2_PLL_DAC2_SCLK, VADJ2_PLL_DAC2_DIN

### Nets
GND: C128.1 C389.1 C391.1 C401.1 C403.1 C408.1 C418.1 C419.1 C421.1 C422.2 C423.1 C424.2 C425.2 C426.1 C427.2 C434.1 C455a.1 C455b.1 C750.2 C763.2 C765.1 C767.2 C845.2 C846.1 C847.2 C887.2 C888.2 IC38.7(VEE) IC38.8(VEE) IC38.17(EP) IC39.1(GND) IC41.11(GND) IC41.12(GND) IC41.13(GND) IC41.22(~{OE}) IC42.1(GND) IC48.2(GND) IC48.4(GND) IC53.8(GND) IC54.3(A) IC82.8(GND) J5.2 OSC1.3(GND) OSC2.3(GND) OSC3.3(GND) Q8.2(S) R26.1 R211.1
OSC_PWR: C418.2 C434.2 FB31.1 IC38.5(VCC) IC38.13(VCC) IC38.14(VCC) IC38.15(VCC) IC38.16(VCC) OSC3.1(OE) OSC3.6(VDD)
P1V5: C128.2 IC39.2(VREF1) R271.1 R439.1
P3V3: C391.2 C401.2 C421.2 FB31.2 IC41.23(VCCB) IC41.24(VCCB) L13.1 R25.1 R214.2 R220.2 R223.2 R272.2 R379.2 R380.2 R381.2 R440.2
P3V3_CLEAN: C455a.2 C455b.2 C750.1 C767.1 C888.1 FB29.2 FB30.2 IC48.7(VCC) IC53.1(VDD) IC82.1(VDD) L13.2 R219.1 R317.2
PVADJ2: C403.2 C408.2 IC41.1(VCCA) IC41.2(DIR) IC42.2(VREF1) R454.1 R455.1
125_FPGA_CLK1_C_N: IC38.4(~{Q1}) ; port 125_FPGA_CLK1_C_N
125_FPGA_CLK1_C_P: IC38.3(Q1) ; port 125_FPGA_CLK1_C_P
125_GTP213_CLK0_N: IC38.2(~{Q0}) ; port 125_GTP213_CLK0_N  [project net MGT.125_GTP213_CLK0_N]
125_GTP213_CLK0_P: IC38.1(Q0) ; port 125_GTP213_CLK0_P  [project net MGT.125_GTP213_CLK0_P]
FPGA_CLK.SI57X_SEC_CLK: R382.2 ; port SI57X_SEC_CLK
OE1: OSC1.2(OE) R563.2
OE2: OSC2.2(NC) R474.2
P3V3_L9: C426.2 C427.1 FB30.1 OSC1.6(VDD)
P3V3_Lx: C846.2 C847.1 FB29.1 OSC2.6(VDD)
PLL_DAC1_DIN: IC41.18(B4) IC53.7(DIN)
PLL_DAC1_SCLK: IC41.20(B2) IC53.6(SCLK)
PLL_DAC1_SYNC_N: IC53.5(~{SYNC}) R449.1
PLL_DAC2_DIN: IC41.19(B3) IC82.7(DIN)
PLL_DAC2_SCLK: IC41.21(B1) IC82.6(SCLK)
PLL_DAC2_SYNC_N: IC82.5(~{SYNC}) R353.1
PLLDAC_OUT1: C422.1 C845.1 OSC2.1(OE) R218.2 R383.1 R384.2  [also labelled SI_TUNE_R_SEC]
PLLDAC_OUT1_R: IC53.3(VFB) IC53.4(VOUT) R218.1
PLLDAC_OUT2: C425.1 C887.1 OSC1.1(NC) R224.1 R352.2 R564.1  [also labelled SI_TUNE_R]
PLLDAC_OUT2_R: IC82.3(VFB) IC82.4(VOUT) R352.1
SEC_CLK: OSC2.4(CLK+) R382.1
SEC_SCL: IC39.6(SCL2) OSC2.8(SCL) R380.1
SEC_SDA: IC39.5(SDA2) OSC2.7(SDA) R381.1
SI57X_PRI_CLK_N: IC48.5(DOUT-) OSC1.5(CLK-) ; port SI57X_PRI_CLK_N
SI57X_PRI_CLK_P: IC48.6(DOUT+) OSC1.4(CLK+) ; port SI57X_PRI_CLK_P
SI57X_PRI_OE: IC41.17(B5) Q8.1(G) R223.1 R563.1 R564.2
SI57X_PRI_SCL: IC42.6(SCL2) OSC1.8(SCL) R220.1
SI57X_PRI_SDA: IC42.5(SDA2) OSC1.7(SDA) R272.1
SI57X_PRI_TUNE/SYNC: IC41.16(B6) R224.2 R353.2
SI57X_SEC_OE: R379.1 R383.2 R474.1 ; port SI57X_SEC_I2C.OE
SI57X_SEC_SCL: IC39.3(SCL1) R439.2 ; port SI57X_SEC_I2C.SCL
SI57X_SEC_SDA: IC39.4(SDA1) R271.2 ; port SI57X_SEC_I2C.SDA
SI57X_SEC_TUNE/SYNC: IC41.15(B7) R384.1 R449.2
VADJ2_PLL_DAC1_DIN: IC41.6(A4) ; port PLL_CTRL.VADJ2_PLL_DAC1_DIN  [project net PLL_CTRL.VADJ2_PLL_DAC1_DIN]
VADJ2_PLL_DAC1_SCLK: IC41.4(A2) ; port PLL_CTRL.VADJ2_PLL_DAC1_SCLK  [project net PLL_CTRL.VADJ2_PLL_DAC1_SCLK]
VADJ2_PLL_DAC2_DIN: IC41.5(A3) ; port PLL_CTRL.VADJ2_PLL_DAC2_DIN  [project net PLL_CTRL.VADJ2_PLL_DAC2_DIN]
VADJ2_PLL_DAC2_SCLK: IC41.3(A1) ; port PLL_CTRL.VADJ2_PLL_DAC2_SCLK  [project net PLL_CTRL.VADJ2_PLL_DAC2_SCLK]
VADJ2_SI57X_PRI_OE: IC41.7(A5) ; port PLL_CTRL.VADJ2_SI57X_PRI_OE  [project net PLL_CTRL.VADJ2_SI57X_PRI_OE]
VADJ2_SI57X_PRI_SCL: IC42.3(SCL1) R455.2 ; port PLL_CTRL.VADJ2_SI57X_PRI_SCL  [project net PLL_CTRL.VADJ2_SI57X_PRI_SCL]
VADJ2_SI57X_PRI_SDA: IC42.4(SDA1) R454.2 ; port PLL_CTRL.VADJ2_SI57X_PRI_SDA  [project net PLL_CTRL.VADJ2_SI57X_PRI_SDA]
VADJ2_SI57X_PRI_TUNE/SYNC: IC41.8(A6) ; port PLL_CTRL.VADJ2_SI57X_PRI_TUNE/SYNC  [project net PLL_CTRL.VADJ2_SI57X_PRI_TUNE/SYNC]
VADJ2_SI57X_SEC_TUNE/SYNC: IC41.9(A7) ; port PLL_CTRL.VADJ2_SI57X_SEC_TUNE/SYNC  [project net PLL_CTRL.VADJ2_SI57X_SEC_TUNE/SYNC]
VREF2V5_WR: C423.2 C424.1 IC53.2(VREF) IC54.1(C) IC54.2(Adj) IC82.2(VREF) R219.2
NetC389_2: C389.2 IC39.7(VREF2) IC39.8(EN) R214.1
NetC419_2: C419.2 IC42.7(VREF2) IC42.8(EN) R440.1
NetC763_1: C763.1 R25.2 R26.2 R315.1 R316.1
NetC764_1: C764.1 IC48.8(RIN+) R315.2
NetC764_2: C764.2 J5.1 R211.2
NetC765_2: C765.2 IC48.1(RIN-) R316.2
NetIC38_9: IC38.9(~{VTD}) R254.2
NetIC38_10: IC38.10(~{D}) OSC3.5(CLK-)
NetIC38_11: IC38.11(D) OSC3.4(CLK+)
NetIC38_12: IC38.12(VTD) R253.2
NetIC48_3: IC48.3(EN) Q8.3(D) R317.1
NetR253_1: R253.1 R254.1

Not connected (* = marked no-connect by the designer): IC38 6(NC); IC41 10(A8) 14(B8); OSC2 5(CLK-)*; OSC3 2(NC)

### Layout directives
differential pair: MGT.125_GTP213_CLK0_N, MGT.125_GTP213_CLK0_P, SI57X_PRI_CLK_N, SI57X_PRI_CLK_P
net class DE_SIG: (no net found under the mark)
net class SE50: (no net found under the mark)
net class POWER: OSC_PWR, P3V3_CLEAN, P3V3_L9, P3V3_Lx, VREF2V5_WR

### Notes on the sheet
- Vc 1.65V +/- 1.65V
- Check OSC Part Number in Variants!
- oscillators available in variants
  549CBAC000112ABG
  571CHC000511DG
  570CAC000121DG
- DAC Vih = 2V so it accepts 2.5V CMOS signal
- DAC ouput range: 0V to 2.5V
- Optional RC filter for 1-bit DAC from FPGA output.
  Can be used to fine tune Si571, which has a control voltage input.
- (near R353) oscillators available in variants
  549BACB001937ABG
  571BFB000449DG
  570BBC000121DG
- Project/Equipment
- Document
- Designer
- Drawn by
- Check.by
- Copyright CNPEM 2013, WUT ISE 2020
  This documentation describes Open Hardware and is licensed under CERN OHL v.1.1. You may redistribute and modify this documentaction under the terms of the CERN OHL v1.1.
  (http://ohwr.org/CERNOHL). This documentation is dristributed WITHOUT ANY EXPRESS OR IMPLIED WARRANTY, INCLUDING OF MERCHANTABLITY, SATISFACTORY QUALITY AND FITNESS FOR A PARTICULAR PURPOSE. Please see the CERN OHL v.1.1 for applicable conditions
- File
- Last Mod.
- Print Date
- Sheet
- Size
- A3
- of
- Rev
- Contact:
- (in symbol R0402_2K2_1%_0.0625W_100PPM) 1%
- (in symbol R0402_4K7_1%_0.0625W_100PPM) 1%
- (in symbol R0402_49R9_1%_0.0625W_100PPM) 1%
- (in symbol R0402_100K_1%_0.0625W_100PPM) 1%
- (in symbol R0402_240R_1%_0.0625W_100PPM) 1%
- (in symbol R0603_5K1_1%_0.1W_100PPM) 1%

### Library data of the parts
C128 C389 C391 C401 C403 C408 C419 C421 C422 C424 C425 C427 C434 C750 C763-C765 C767 C845 C847 C887 C888 = CC0201_100NF_6.3V_10%_X5R: as C212 on sheet Clock_management; Part Number: CC0201_100NF_6.3V_10%_X5R; Component Kind: Standard; Component Type: Standard; Pin Count: 2; Value: 100nF; Status: Not Recommended; Manufacturer Part Number: CC0201_100NF_6.3V_10%_X5R; Case: 0201; Mounted: Yes; Socket: No; SMD: Yes; Manufacturer1 Example: AVX; Manufacturer1 ComponentHeight: 0.33mm; HelpURL: \\cern.ch\dfs\Applications\Altium\Datasheets\CC0201_X5R_AVX.pdf; Author: CERN DEM JLC; CreateDate: 2007-12-03; LatestRevisionDate: 2007-12-03
C418 = CC0201_100NF_6.3V_10%_X5R: Non-polarised capacitor; Manufacturer: GENERIC; Part Description: SMD Multilayer Chip Ceramic Capacitor; Manufacturer1 Part Number: 02016D104KAT2A; Tolerance: ±10%; Voltage: 6.3V; TC: X5R; Manufacturer Part Number: CC0201_100NF_6.3V_10%_X5R; Part Number: CC0201_100NF_6.3V_10%_X5R; Value: 100nF; Component Kind: Standard; Component Type: Standard; Pin Count: 2; Status: Not Recommended; Case: 0201; Mounted: Yes; Socket: No; SMD: Yes; Sense: No; Manufacturer1 Example: AVX; Manufacturer1 ComponentHeight: 0.33mm; HelpURL: \\cern.ch\dfs\Applications\Altium\Datasheets\CC0201_X5R_AVX.pdf; Author: CERN DEM JLC; CreateDate: 03.12.2007; LatestRevisionDate: 03.12.2007
C423 C455a C455b = CC1206_22UF_10V_10%_X7R: as C454 on sheet Clock_management; Part Number: CC1206_22UF_10V_10%_X7R; Component Kind: Standard; Component Type: Standard; Pin Count: 2; Value: 22uF; Status: Preferred; Manufacturer Part Number: CC1206_22UF_10V_10%_X7R; Case: 1206; Mounted: Yes; Socket: No; SMD: Yes; Manufacturer1 Example: MURATA; Manufacturer1 ComponentHeight: 1.8mm; HelpURL: \\cern.ch\dfs\Applications\Altium\Datasheets\CC1206_X7R_MURATA_GRM-HI-CAP.pdf; Author: CERN DEM JLC; CreateDate: 2010-06-08; LatestRevisionDate: 2010-06-08
C426 C846 = CC0603_1UF_16V_10%_X7R: Non-polarised capacitor; Part Description: SMD Multilayer Chip Ceramic Capacitor; Manufacturer: GENERIC; Manufacturer1 Part Number: 223824613663; Voltage: 16V; TC: X7R; Tolerance: ±10%; Table: Capacitors SMD; Part Number: CC0603_1UF_16V_10%_X7R; Component Kind: Standard; Component Type: Standard; Pin Count: 2; Value: 1uF; Status: Preferred; Manufacturer Part Number: CC0603_1uF_16V_10%_X7R; Case: 0603; Mounted: Yes; Socket: No; SMD: Yes; Manufacturer1 Example: PHYCOMP; Manufacturer1 ComponentHeight: 0.87mm; HelpURL: \\cern.ch\dfs\Applications\Altium\Datasheets\CC0805_X5R_PHYCOMP_HC.pdf; Author: CERN DEM JLC; CreateDate: 03/12/2007; LatestRevisionDate: 03/12/2007
FB29 FB30 = IND0805_MURATA_BLM21PG221SN1D: Inductor; Part Description: SMD EMIFIL Suppression Chip Bead Ferrite; Manufacturer: MURATA; Power: 2A; Resistance: 0.05R; Tolerance: ±25%; Table: Inductors SMD; Part Number: IND0805_MURATA_BLM21PG221SN1D; Component Kind: Standard; Component Type: Standard; Pin Count: 2; Value: 220R@100MHz; Status: None; Manufacturer Part Number: BLM21PG221SN1D; Case: 0805; Mounted: Yes; Socket: No; SMD: Yes; ComponentHeight: 1.05mm; HelpURL: \\cern.ch\dfs\Applications\Altium\Datasheets\IND0402_MURATA_BLM21P.pdf; Author: CERN DEM JLC; CreateDate: 25/01/2010; LatestRevisionDate: 25/01/2010
FB31 = IND0402_MURATA_BLM15PX121SN1D: Manufacturer: MURATA; Part Description: SMD EMIFIL Chip Ferrite Bead; Tolerance: ±25%; Power: 2A; Resistance: 0.055R; Manufacturer Part Number: BLM15PX121SN1D; Part Number: IND0402_MURATA_BLM15PX121SN1D; Value: 120R@100MHz; Component Kind: Standard; Component Type: Standard; Pin Count: 2; Status: None; Case: 0402; Mounted: Yes; Socket: No; SMD: Yes; Sense: No; ComponentHeight: 0.55mm; HelpURL: \\cern.ch\dfs\Applications\Altium\Datasheets\IND0402_MURATA_BLM15PX.pdf; Author: CERN DEM JMW; CreateDate: 19.02.2014; LatestRevisionDate: 25.10.2018
IC38 = NB6N11SMNG: as IC51 on sheet Clock_management; Part Number: NB6N11SMNG; Component Kind: Standard; Component Type: Standard; Device: NB6N11SMNG; PackageDescription: QFN, 0.50mm Pitch, Square; 16 Pin, 3.00mm L X 3.00mm W X 1.00mm H body (w/Thermal Tab 1.85 X 1.85mm), IPC Medium Density; Part Description: 3.3V 1:2 AnyLevel Input to LVDS Fanout Buffer / Translator; Manufacturer Part Number: NB6N11SMNG; Pin Count: 17; Case: QFN16; Mounted: Yes; Socket: No; SMD: Yes; Sense: No; ComponentHeight: 1mm; Author: CERN DEM JLC; HelpURL: \\cern.ch\dfs\Applications\Altium\Datasheets\NB6N11SMNG.pdf; CreateDate: 14.05.2013; LatestRevisionDate: 14.05.2013
IC39 IC42 = PCA9306DCTR: Dual Bidirectional I2C Bus And SMBus Voltage-Level Translator; Manufacturer: TEXAS INSTRUMENTS; PressFit: No; Bonding: No; Part Number: PCA9306DCTR; Component Kind: Standard; Component Type: Standard; Device: PCA9306DCTR; PackageDescription: SOP, 0.65mm, Pitch; 8 Pin, 2.80mm W X 2.95mm L X 1.30mm H Body, PC Medium Density; Part Description: Dual Bidirectional I2C Bus And SMBus Voltage-Level Translator; Manufacturer Part Number: PCA9306DCTR; Pin Count: 8; Case: SSOP8; Mounted: Yes; Socket: No; SMD: Yes; Sense: No; ComponentHeight: 1.3mm; Author: CERN DEM JLC; HelpURL: \\cern.ch\dfs\Applications\Altium\Datasheets\PCA9306DCTR.pdf; CreateDate: 25.02.2013; LatestRevisionDate: 11.02.2016
IC41 = SN74AVC8T245RHL: 8-Bit Dual-Supply Bus Transceiver With Configurable Voltage Translation and 3-State Outputs; Manufacturer: TEXAS INSTRUMENTS; PressFit: No; Bonding: No; Part Number: SN74AVC8T245RHL; Component Kind: Standard; Component Type: Standard; Device: SN74AVC8T245RHL; PackageDescription: TEXAS Case Style RHL (S-PVQFN-N24), QFN, 0.50mm Pitch, Rectangular; 24 Pin, 5.50mm L X 3.50mm W X 1mm H body (w/thermal tab 4.05 X 2.05mm); Part Description: 8-Bit Dual-Supply Bus Transceiver With Configurable Voltage Translation and 3-State Outputs; Manufacturer Part Number: SN74AVC8T245RHL; Pin Count: 25; Case: QFN24; Mounted: Yes; Socket: No; SMD: Yes; Sense: No; ComponentHeight: 1.0mm; Author: CERN DEM MR; HelpURL: \\cern.ch\dfs\Applications\Altium\Datasheets\SN74AVC8T245RHL.pdf; CreateDate: 09.11.2016; LatestRevisionDate: 09.11.2016
IC48 = FIN1101K8X: as IC50 on sheet Clock_management; Part Number: FIN1101K8X; Component Kind: Standard; Component Type: Standard; Device: FIN1101K8X; PackageDescription: SOP, 0.50mm Pitch; 8 pin, 2.30mm W X 2.00mm L X 0.90mm H body, PC Medium Density; Part Description: LVDS Single Port High Speed Repeater; Manufacturer Part Number: FIN1101K8X; Pin Count: 8; Case: TSSOP8; Mounted: Yes; Socket: No; SMD: Yes; Sense: No; ComponentHeight: 0.8mm; Author: CERN DEM JLC; HelpURL: \\cern.ch\dfs\Applications\Altium\Datasheets\FIN1101K8X.pdf; CreateDate: 08.11.2016; LatestRevisionDate: 08.11.2016
IC53 IC82 = AD5662BRMZ-1: 2.7V to 5.5V, 250uA, Rail-to-Rail Output 16-Bit nanoDAC; Manufacturer: ANALOG DEVICES; Table: Analog & Interface; Part Number: AD5662BRMZ-1; Component Kind: Standard; Component Type: Standard; Device: AD5662BRMZ-1; PackageDescription: SOP, 8-Leads, Body 3.0x3.0mm, Pitch 0.65mm, IPC Medium Density; Part Description: 2.7V to 5.5V, 250uA, Rail-to-Rail Output 16-Bit nanoDAC; Manufacturer Part Number: AD5662BRMZ-1; Pin Count: 8; Case: MSOP8; Mounted: Yes; Socket: No; SMD: Yes; ComponentHeight: 1.1mm; Author: CERN DEM JLC; HelpURL: \\cern.ch\dfs\Applications\Altium\Datasheets\AD5662BRMZ-1.pdf; CreateDate: 1/10/2011; LatestRevisionDate: 1/10/2011
IC54 = TL431ACDBZT: Precision Reference 1=Cathode 2=Adj 3=Anode; Part Description: Vref (2.5V) To 36V 1% Precision Programmable Reference; Manufacturer: TEXAS INSTRUMENTS; PressFit: No; Bonding: No; Part Number: TL431ACDBZT; Component Kind: Standard; Component Type: Standard; Device: TL431ACDBZT; PackageDescription: SOT, 0.95mm, Pitch; 3 pin,1.30mm W X 2.92mm L X 1.12mm H Body, IPC Medium Density; Manufacturer Part Number: TL431ACDBZT; Pin Count: 3; Case: SOT23; Mounted: Yes; Socket: No; SMD: Yes; Sense: No; ComponentHeight: 1.12mm; HelpURL: \\cern.ch\dfs\Applications\Altium\Datasheets\TL431ACDBZT.pdf; Author: CERN DEM JLC; CreateDate: 28.02.2011; LatestRevisionDate: 28.02.2011
J5 = HIROSE_U.FL-R-SMT-1(10): as J7 on sheet Clock_management; Part Number: HIROSE_U.FL-R-SMT-1(10); Component Kind: Standard; Component Type: Standard; Pin Count: 2; Family: U.FL; Mounted: Yes; Socket: No; SMD: Yes; Sense: No; Status: None; Manufacturer Part Number: U.FL-R-SMT-1(10); ComponentHeight: 1.25mm; HelpURL: \\cern.ch\dfs\Applications\Altium\Datasheets\HIROSE_U.FL-R-SMT-1(10).pdf; Author: CERN DEM JLC; CreateDate: 24.03.2010; LatestRevisionDate: 24.03.2010
L13 = IND_1UH_30%_PANASONIC_ELLVGG1R0N: as L11 on sheet Clock_management; Part Number: IND_1UH_30%_PANASONIC_ELLVGG1R0N; Component Kind: Standard; Component Type: Standard; Pin Count: 2; Value: 1uH; Status: None; Manufacturer: PANASONIC; Manufacturer Part Number: ELLVGG1R0N; Mounted: Yes; Socket: No; SMD: Yes; Sense: No; ComponentHeight: 1.5mm; HelpURL: \\cern.ch\dfs\Applications\Altium\Datasheets\IND_PANASONIC_ELLVGG.pdf; Author: CERN DEM JLC; CreateDate: 09.11.2016; LatestRevisionDate: 09.11.2016
OSC1 = OSC_10-280MHZ_SILICON-LAB_Si570BBC000121DG: Any-Rate I2C Programmable XO Oscillator Si570 Serie; Part Description: 10-280MHz 3.3V ±20ppm LVDS Any-Rate I2C Programmable XO Oscillator Si570 Serie; Manufacturer: SILICON LABS; Table: Crystals & Oscillators; Part Number: OSC_10-280MHZ_SILICON-LAB_Si570BBC000121DG; Component Kind: Standard; Component Type: Standard; PackageDescription: Oscillator Si570 Serie, 8 pins, 5x7mm; Value: 10-280MHz; Pin Count: 8; Mounted: Yes; Socket: No; SMD: Yes; ComponentHeight: 1.85mm; HelpURL: \\cern.ch\dfs\Applications\Altium\Datasheets\OSC_SILICON-LAB_SI570.pdf; Author: CERN DEM JLC; CreateDate: 2/9/2010; LatestRevisionDate: 2/9/2010
OSC2 = OSC_0.2-800MHZ_SILICON-LAB_549BACB001937ABG: Ultra Low Jitter I2C Programmable Crystal Oscillator (XO), Si549 Series; Part Description: 0.2-800MHz, 1.8V/2.5V/3.3V ±20ppm LVDS, Ultra Low Jitter I2C Programmable Crystal Oscillator (XO), Si549 Series; Manufacturer: SILICON LABS; PressFit: No; Bonding: No; Part Number: OSC_0.2-800MHZ_SILICON-LAB_549BACB001937ABG; Component Kind: Standard; Component Type: Standard; PackageDescription: Oscillator Si549 Series, 8 pins, 5x7mm; Value: 0.2-800MHz; Pin Count: 8; Mounted: Yes; Socket: No; SMD: Yes; Sense: No; ComponentHeight: 1.33mm; HelpURL: \\cern.ch\dfs\Applications\Altium\Datasheets\OSC_SILICON-LAB_SI549.pdf; Author: CERN DEM JMW; CreateDate: 27.11.2019; LatestRevisionDate: 02.12.2019
OSC3 = OSC_125MHZ_SILICON-LAB_511BBA125M000BAGR: Crystal Oscillator 6 pins, Si511 (LVDS/LVPECL/HCSL/Dual CMOS); Part Description: 3.3V, ±50ppm, -40°C to +85°C, LVDS XO Oscillator, Si510 Series; Manufacturer: SILICON LABS; PressFit: No; Bonding: No; Part Number: OSC_125MHZ_SILICON-LAB_511BBA125M000BAGR; Component Kind: Standard; Component Type: Standard; PackageDescription: Oscillator Si510 Series, 6 pins, 3.2x5mm; Value: 125MHz; Manufacturer Part Number: 511BBA125M000BAGR; Pin Count: 6; Mounted: Yes; Socket: No; SMD: Yes; Sense: No; ComponentHeight: 1.28mm; HelpURL: \\cern.ch\dfs\Applications\Altium\Datasheets\OSC_SILICON-LAB_SI511.pdf; Author: CERN DEM JLC; CreateDate: 26.11.2018; LatestRevisionDate: 26.11.2018
Q8 = BSS138LT1G: N-CHANNEL MOSFET WITH DIODE; Part Description: 50V 200mA N-Channel Enhancement Mode Field-Effect Transistor; Manufacturer: ON SEMICONDUCTOR; PressFit: No; Bonding: No; Part Number: BSS138LT1G; Component Kind: Standard; Component Type: Standard; Device: BSS138LT1G; PackageDescription: SOT23 3-Leads, Pitch 0.95mm - Body 1.4x3mm, IPC Medium Density; Manufacturer Part Number: BSS138LT1G; Pin Count: 3; Case: SOT23-3; Mounted: Yes; Socket: No; SMD: Yes; Sense: No; ComponentHeight: 1.11mm; HelpURL: \\cern.ch\dfs\Applications\Altium\Datasheets\BSS138LT1G.pdf; Author: CERN DEM JLC; CreateDate: 23.03.2009; LatestRevisionDate: 23.03.2009
R25 R26 R223 R315-R317 R379 = R0603_5K1_1%_0.1W_100PPM: Resistor - 1%; Part Description: General Purpose Thick Film Chip Resistor; Manufacturer: GENERIC; Manufacturer1 Part Number: NRC06F5101TRF; Power: 0.1W; TC: ±100ppm/°C; Table: Resistors SMD; Part Number: R0603_5K1_1%_0.1W_100PPM; Component Kind: Standard; Component Type: Standard; Pin Count: 2; Value: 5k1; Status: Preferred; Tolerance: ±1%; Manufacturer Part Number: R0603_5K1_1%_0.1W_100PPM; Case: 0603; Mounted: Yes; Socket: No; SMD: Yes; Manufacturer1 Example: NIC COMPONENT; Manufacturer1 ComponentHeight: 0.55mm; HelpURL: \\cern.ch\dfs\Applications\Altium\Datasheets\R0603_NIC_NRC.pdf; Author: CERN DEM JLC; CreateDate: 03/12/2007; LatestRevisionDate: 13/03/2008
R211 R382 = R0402_49R9_1%_0.0625W_100PPM: Resistor - 1%; Part Description: General Purpose Thick Film Chip Resistor; Manufacturer: GENERIC; Manufacturer1 Part Number: 232270674999L or RC0402FR-0749R9L; TC: ±100ppm/°C; Table: Resistors SMD; Part Number: R0402_49R9_1%_0.0625W_100PPM; Component Kind: Standard; Component Type: Standard; Pin Count: 2; Value: 49R9; Status: Not recommended; Power: 0.0625W; Tolerance: ±1%; Manufacturer Part Number: R0402_49R9_1%_0.0625W_100PPM; Case: 0402; Mounted: Yes; Socket: No; SMD: Yes; Manufacturer1 Example: YAGEO PHYCOMP; Manufacturer1 ComponentHeight: 0.4mm; HelpURL: \\cern.ch\dfs\Applications\Altium\Datasheets\R0402_Phycomp_RC0402.pdf; Author: CERN DEM JLC; CreateDate: 2012-10-24; LatestRevisionDate: 2012-10-24
R214 R440 = R0402_100K_1%_0.0625W_100PPM: Resistor - 1%; Part Description: General Purpose Thick Film Chip Resistor; Manufacturer: GENERIC; Manufacturer1 Part Number: 232270671004L; TC: ±100ppm/°C; Table: Resistors SMD; Part Number: R0402_100K_1%_0.0625W_100PPM; Component Kind: Standard; Component Type: Standard; Pin Count: 2; Value: 100k; Status: Not recommended; Power: 0.0625W; Tolerance: ±1%; Manufacturer Part Number: R0402_100K_1%_0.0625W_100PPM; Case: 0402; Mounted: Yes; Socket: No; SMD: Yes; Manufacturer1 Example: YAGEO PHYCOMP; Manufacturer1 ComponentHeight: 0.4mm; HelpURL: \\cern.ch\dfs\Applications\Altium\Datasheets\R0402_Phycomp_RC0402.pdf; Author: CERN DEM JLC; CreateDate: 2007-12-03; LatestRevisionDate: 2012-10-17
R218 R219 R352 = R0402_240R_1%_0.0625W_100PPM: Resistor - 1%; Part Description: General Purpose Thick Film Chip Resistor; Manufacturer: GENERIC; Manufacturer1 Part Number: 232270672401L; TC: ±100ppm/°C; Table: Resistors SMD; Part Number: R0402_240R_1%_0.0625W_100PPM; Component Kind: Standard; Component Type: Standard; Pin Count: 2; Value: 240; Status: Not recommended; Power: 0.0625W; Tolerance: ±1%; Manufacturer Part Number: R0402_240R_1%_0.0625W_100PPM; Case: 0402; Mounted: Yes; Socket: No; SMD: Yes; Manufacturer1 Example: YAGEO PHYCOMP; Manufacturer1 ComponentHeight: 0.4mm; HelpURL: \\cern.ch\dfs\Applications\Altium\Datasheets\R0402_Phycomp_RC0402.pdf; Author: CERN DEM JLC; CreateDate: 2007-12-03; LatestRevisionDate: 2012-10-17
R220 R272 R380 R381 = R0402_4K7_1%_0.0625W_100PPM: Resistor - 1%; Manufacturer: GENERIC; Part Description: General Purpose Thick Film Chip Resistor; Manufacturer1 Part Number: 232270674702L; TC: ±100ppm/°C; PressFit: No; Manufacturer Part Number: R0402_4K7_1%_0.0625W_100PPM; Part Number: R0402_4K7_1%_0.0625W_100PPM; Tolerance: ±1%; Value: 4k7; Component Kind: Standard; Component Type: Standard; Pin Count: 2; Status: Not Recommended; Power: 0.0625W; Case: 0402; Mounted: Yes; Sense: No; Socket: No; SMD: Yes; Manufacturer1 Example: YAGEO PHYCOMP; Manufacturer1 ComponentHeight: 0.4mm; HelpURL: \\cern.ch\dfs\Applications\Altium\Datasheets\R0402_Phycomp_RC0402.pdf; Author: CERN DEM JLC; CreateDate: 03.12.2007; LatestRevisionDate: 17.10.2012
R224 R253 R254 R353 R383 R384 R449 R474 R563 R564 = R0402_0R_JUMPER: as R27 on sheet Clock_management; Part Number: R0402_0R_JUMPER; Component Kind: Standard; Component Type: Standard; Pin Count: 2; Value: 0; Status: Not Recommended; Manufacturer Part Number: R0402_0R_JUMPER; Case: 0402; Mounted: Yes; Sense: No; Socket: No; SMD: Yes; Manufacturer1 Example: YAGEO PHYCOMP; Manufacturer1 ComponentHeight: 0.4mm; HelpURL: \\cern.ch\dfs\Applications\Altium\Datasheets\R0402_Phycomp_RC0402.pdf; Author: CERN DEM JLC; CreateDate: 03.12.2007; LatestRevisionDate: 17.10.2012
R271 R439 R454 R455 = R0402_2K2_1%_0.0625W_100PPM: Resistor - 1%; Part Description: General Purpose Thick Film Chip Resistor; Manufacturer: GENERIC; Manufacturer1 Part Number: 232270672202L; TC: ±100ppm/°C; Table: Resistors SMD; Part Number: R0402_2K2_1%_0.0625W_100PPM; Component Kind: Standard; Component Type: Standard; Pin Count: 2; Value: 2k2; Status: Not recommended; Power: 0.0625W; Tolerance: ±1%; Manufacturer Part Number: R0402_2K2_1%_0.0625W_100PPM; Case: 0402; Mounted: Yes; Socket: No; SMD: Yes; Manufacturer1 Example: YAGEO PHYCOMP; Manufacturer1 ComponentHeight: 0.4mm; HelpURL: \\cern.ch\dfs\Applications\Altium\Datasheets\R0402_Phycomp_RC0402.pdf; Author: CERN DEM JLC; CreateDate: 2007-12-03; LatestRevisionDate: 2012-10-17